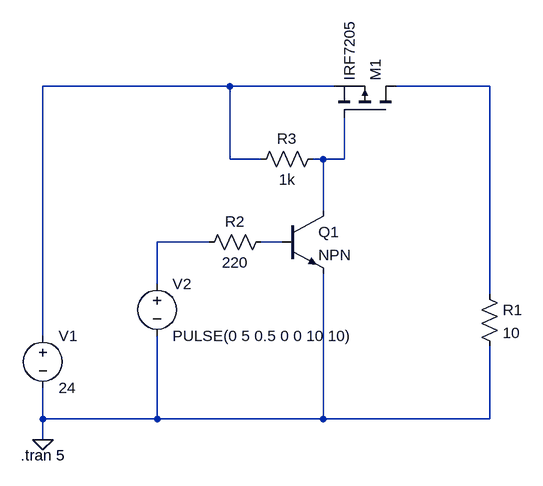
[diagram p0: schematic high_side_switch.asc]
high_side_switch.asc, the LTspice schematic file:
Version 4
SHEET 1 880 680
WIRE 320 -240 32 -240
WIRE 480 -240 320 -240
WIRE 720 -240 576 -240
WIRE 320 -128 320 -240
WIRE 368 -128 320 -128
WIRE 464 -128 448 -128
WIRE 496 -128 496 -192
WIRE 496 -128 464 -128
WIRE 464 -48 464 -128
WIRE 288 0 208 0
WIRE 400 0 368 0
WIRE 208 64 208 0
WIRE 720 80 720 -240
WIRE 32 144 32 -240
WIRE 32 272 32 224
WIRE 208 272 208 144
WIRE 208 272 32 272
WIRE 464 272 464 48
WIRE 464 272 208 272
WIRE 720 272 720 160
WIRE 720 272 464 272
WIRE 32 304 32 272
FLAG 32 304 0
SYMBOL voltage 32 128 R0
WINDOW 123 0 0 Left 0
WINDOW 39 0 0 Left 0
SYMATTR InstName V1
SYMATTR Value 24
SYMBOL res 704 64 R0
SYMATTR InstName R1
SYMATTR Value 10
SYMBOL pmos 576 -192 M270
SYMATTR InstName M1
SYMATTR Value IRF7205
SYMBOL voltage 208 48 R0
WINDOW 123 0 0 Left 0
WINDOW 39 0 0 Left 0
SYMATTR InstName V2
SYMATTR Value PULSE(0 5 0.5 0 0 10 10)
SYMBOL npn 400 -48 R0
SYMATTR InstName Q1
SYMBOL res 384 -16 R90
WINDOW 0 0 56 VBottom 2
WINDOW 3 32 56 VTop 2
SYMATTR InstName R2
SYMATTR Value 220
SYMBOL res 464 -144 R90
WINDOW 0 0 56 VBottom 2
WINDOW 3 32 56 VTop 2
SYMATTR InstName R3
SYMATTR Value 1k
TEXT -2 328 Left 2 !.tran 5

The netlist it stands for:
* high_side_switch.asc
V1 N001 0 24
R1 N002 0 10
M1 N002 N003 N001 N001 IRF7205
V2 N004 0 PULSE(0 5 0.5 0 0 10 10)
Q1 N003 N005 0 0 NPN
R2 N005 N004 220
R3 N003 N001 1k
.model NPN NPN
.model PNP PNP
.lib standard.bjt
.model NMOS NMOS
.model PMOS PMOS
.lib standard.mos
.tran 5
.backanno
.end